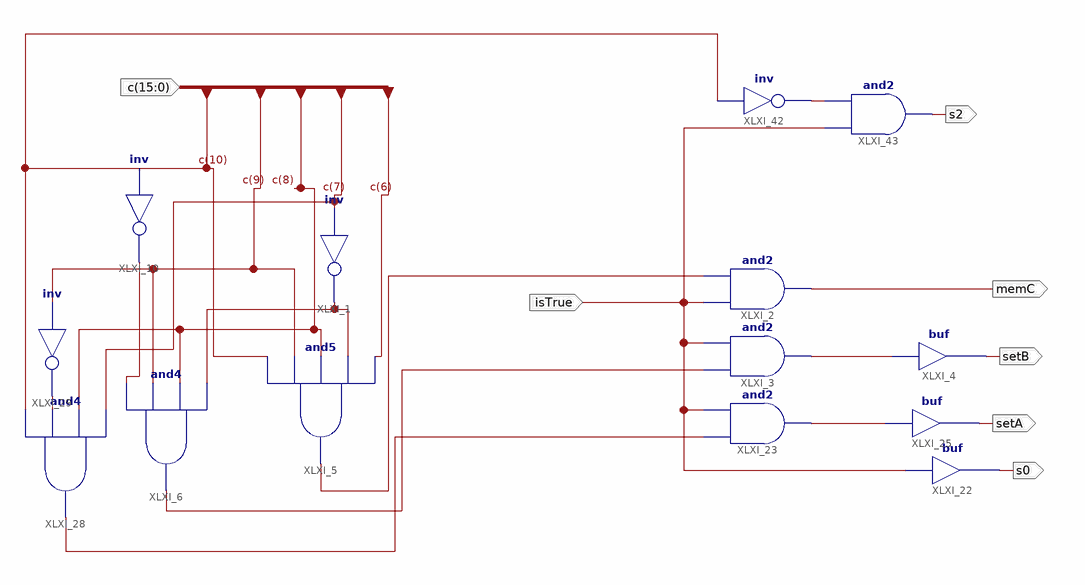
[diagram p0: schematic sheet 1]
// Xilinx ISE schematic ALUI.sch (spartan3e) as structural Verilog: 14 symbols, 7 ports
module ALUI (
  input  isTrue,
  input  [15:0] c,
  output memC,
  output setB,
  output s0,
  output setA,
  output s2
);

  wire XLXN_15, XLXN_24, XLXN_27, XLXN_35, XLXN_37, XLXN_61, XLXN_62, XLXN_66, XLXN_92;

  not XLXI_1 (XLXN_15, c[7]);
  and XLXI_2 (memC, isTrue, XLXN_24);
  and XLXI_3 (XLXN_27, XLXN_37, isTrue);
  buf XLXI_4 (setB, XLXN_27);
  and XLXI_5 (XLXN_24, c[10], c[9], c[8], XLXN_15, c[6]);
  and XLXI_6 (XLXN_37, XLXN_35, c[9], c[8], XLXN_15);
  buf XLXI_22 (s0, isTrue);
  and XLXI_23 (XLXN_61, XLXN_66, isTrue);
  buf XLXI_25 (setA, XLXN_61);
  and XLXI_28 (XLXN_66, c[10], XLXN_62, c[8], c[7]);
  not XLXI_29 (XLXN_62, c[9]);
  not XLXI_10 (XLXN_35, c[10]);
  not XLXI_42 (XLXN_92, c[10]);
  and XLXI_43 (s2, isTrue, XLXN_92);
endmodule
